# EAGLE design TinyRulerPE (EAGLE 9.6.2)
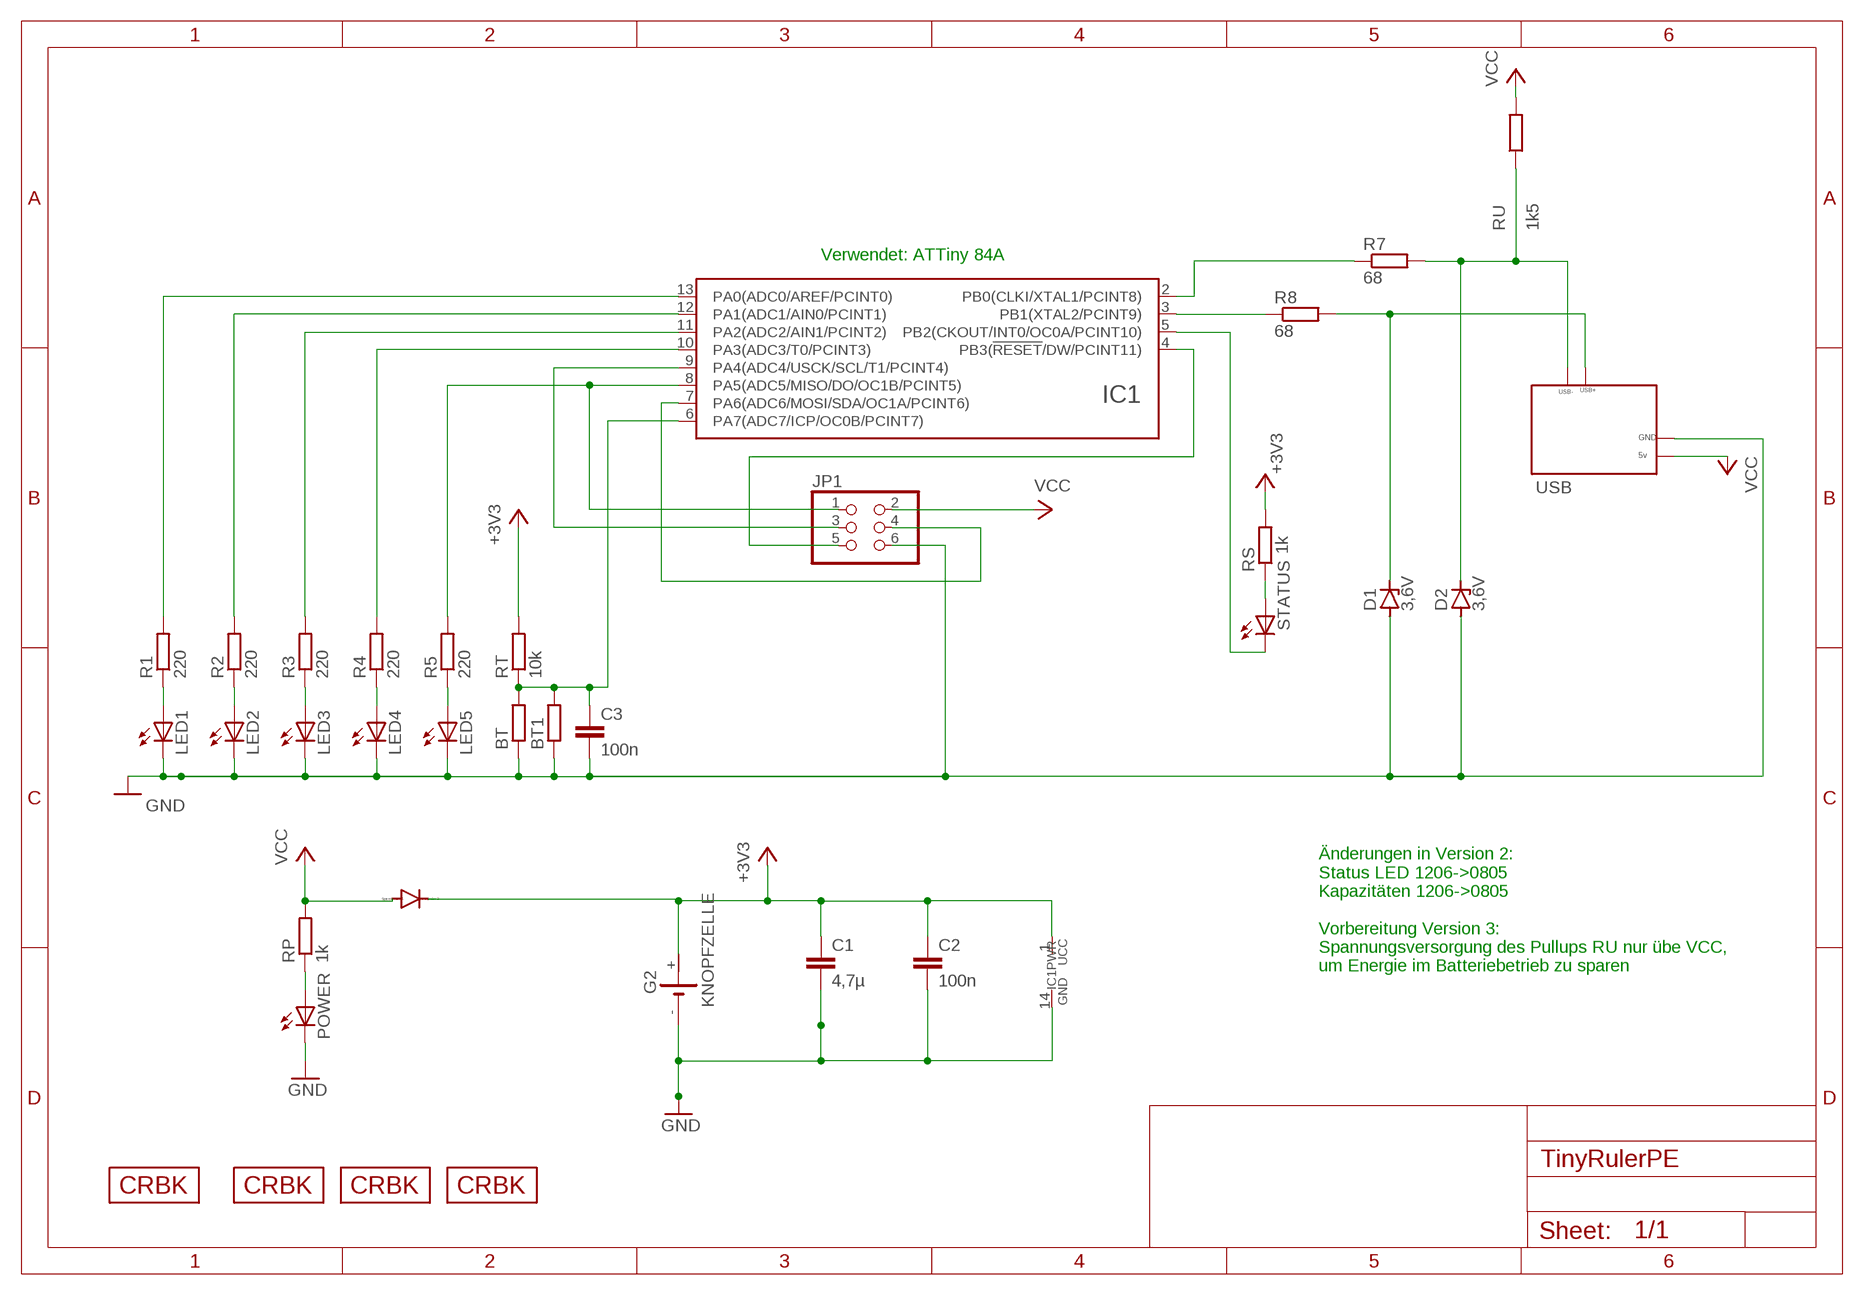
[diagram p0: schematic, sheet 1]

## Parts
BT  R-EU_0411/15  [0411/15]
BT1  R-EU_0309/10  [0309/10]
C1  4,7µ  C-EUC0805  [C0805]
C2  100n  C-EUC0805  [C0805]
C3  100n  C-EUC0805  [C0805]
D1  3,6V  ZENER-DIODESOT23  [SOT23]
D2  3,6V  ZENER-DIODESOT23  [SOT23]
D4  DIODE-SOD323-W  [SOD323-W]
G2  KNOPFZELLE  [KZH20]
IC1  ATTINY24/44/84-SSU  [SOIC14]
JP1  PINHD-2X3  [2X03]
L1  CRBKLOGO-2020TN_TEXT  [CRBK-LOGO-2020-XS-TN-TEXT]
L2  CRBKLOGO-2020TN_S_BILD  [CRBK-LOGO-2020-S-TN-BILD]
L3  CRBKLOGO-2020TN_S_BILD  [CRBK-LOGO-2020-S-TN-BILD]
L4  CRBKLOGO-2020TN_TEXT  [CRBK-LOGO-2020-XS-TN-TEXT]
LED1  LEDCHIPLED_1206  [CHIPLED_1206]
LED2  LEDCHIPLED_1206  [CHIPLED_1206]
LED3  LEDCHIPLED_1206  [CHIPLED_1206]
LED4  LEDCHIPLED_1206  [CHIPLED_1206]
LED5  LEDCHIPLED_1206  [CHIPLED_1206]
POWER  LEDCHIPLED_0805  [CHIPLED_0805]
R1  220  R-EU_R0805  [R0805]
R2  220  R-EU_R0805  [R0805]
R3  220  R-EU_R0805  [R0805]
R4  220  R-EU_R0805  [R0805]
R5  220  R-EU_R0805  [R0805]
R7  68  R-EU_R0805  [R0805]
R8  68  R-EU_R0805  [R0805]
RP  1k  R-EU_R0805  [R0805]
RS  1k  R-EU_R0805  [R0805]
RT  10k  R-EU_R0805  [R0805]
RU  1k5  R-EU_R0805  [R0805]
STATUS  LEDCHIPLED_0805  [CHIPLED_0805]
USB  USBCONNECTOR  [USBCONNECTOR]

## Nets
+3V3: C1.1 C2.1 D4.C G2.+ IC1.1(UCC) RS.2 RT.2
GND: BT1.1 BT.1 C1.2 C2.2 C3.2 D1.1(A) D2.1(A) G2.- IC1.14(GND) JP1.6 LED1.C LED2.C LED3.C LED4.C LED5.C POWER.C USB.GND
N$1: LED2.A R2.1
N$2: LED1.A R1.1
N$3: LED3.A R3.1
N$4: LED4.A R4.1
N$5: LED5.A R5.1
N$6: IC1.9(PA4(ADC4/USCK/SCL/T1/PCINT4)) JP1.3
N$7: IC1.8(PA5(ADC5/MISO/DO/OC1B/PCINT5)) JP1.1 R5.2
N$8: IC1.13(PA0(ADC0/AREF/PCINT0)) R1.2
N$9: IC1.4(PB3(!RESET!/DW/PCINT11)) JP1.5
N$10: BT1.2 BT.2 C3.1 IC1.6(PA7(ADC7/ICP/OC0B/PCINT7)) RT.1
N$11: IC1.12(PA1(ADC1/AIN0/PCINT1)) R2.2
N$12: D1.3(C) R8.2 USB.USB+
N$13: D2.3(C) R7.2 RU.1 USB.USB-
N$14: IC1.11(PA2(ADC2/AIN1/PCINT2)) R3.2
N$15: POWER.A RP.1
N$16: IC1.5(PB2(CKOUT/INT0/OC0A/PCINT10)) STATUS.C
N$17: IC1.7(PA6(ADC6/MOSI/SDA/OC1A/PCINT6)) JP1.4
N$18: RS.1 STATUS.A
N$19: IC1.10(PA3(ADC3/T0/PCINT3)) R4.2
N$20: IC1.2(PB0(CLKI/XTAL1/PCINT8)) R7.1
N$21: IC1.3(PB1(XTAL2/PCINT9)) R8.1
VCC: D4.A JP1.2 RP.2 RU.2 USB.+5V(5V)

## Notes on the sheet
- Verwendet: ATTiny 84A
- Änderungen in Version 2:
  Status LED 1206->0805
  Kapazitäten 1206->0805
  
  Vorbereitung Version 3:
  Spannungsversorgung des Pullups RU nur übe VCC,
  um Energie im Batteriebetrieb zu sparen

## Library data of the parts
BT BT1 R1-R5 R7 R8 RP RS RT RU = rcl:R-EU_: RESISTOR, European symbol; SPICEPREFIX: R
C1-C3 = rcl:C-EU: CAPACITOR, European symbol; SPICEPREFIX: C
D1 D2 = diode:ZENER-DIODE: Z-Diode
D4 = diode:DIODE-: DIODE
G2 = CRBK:KNOPFZELLE: LI BATTERY
IC1 = atmel_tiny24-44-84tiny48-88mega48-88-168-328:ATTINY24/44/84
JP1 = pinhead:PINHD-2X3: PIN HEADER
L1-L4 = CRBK:CRBKLOGO-2020
LED1-LED5 POWER STATUS = 1a BK_Hennef 10_18:LED: LED OSRAM: - CHIPLED LG R971, LG N971, LY N971, LG Q971, LY Q971, LO R971, LY R971 LH N974, LH R974 LS Q976, LO Q976, LY Q976 LO Q996 - Hyper CHIPLED LW Q18S LB Q993, LB Q99A, LB R99A - SideLED LS A670, LO A670, LY A670, LG A670, LP A670 LB A673, LV A673, LT A673, LW A673 LH A674 LY A675 LS A676, LA A676, LO A676, LY A676, LW A676 LS A679, LY A679, LG A679 - Hyper Micro SIDELED® LS Y876, LA Y876, LO Y876, LY Y876 LT Y87S - SmartLED LW L88C, LW L88S LB L89C, LB L89S, LG L890 LS L89K, LO L89K, LY L89K LS L896, LA L896, LO L896, LY L896 - TOPLED LS T670, LO T670, LY T670, LG T670, LP T670 LSG T670, LSP T670, LSY T670, LOP T670, LYG T670 LG T671, LOG T671, LSG T671 LB T673, LV T673, LT T673, LW T673 LH T674 LS T676, LA T676, LO T676, LY T676, LB T676, LH T676, LSB T676, LW T676 LB T67C, LV T67C, LT T67C, LS T67K, LO T67K, LY T67K, LW E67C LS E67B, LA E67B, LO E67B, LY E67B, LB E67C, LV E67C, LT E67C LW T67C LS T679, LY T679, LG T679 LS T770, LO T770, LY T770, LG T770, LP T770 LB T773, LV T773, LT T773, LW T773 LH T774 LS E675, LA E675, LY E675, LS T675 LS T776, LA T776, LO T776, LY T776, LB T776 LHGB T686 LT T68C, LB T68C - Hyper Mini TOPLED® LB M676 - Mini TOPLED Santana® LG M470 LS M47K, LO M47K, LY M47K Source: http://www.osram.convergy.de LUXEON: - LUMILED® LXK2-PW12-R00, LXK2-PW12-S00, LXK2-PW14-U00, LXK2-PW14-V00 LXK2-PM12-R00, LXK2-PM12-S00, LXK2-PM14-U00 LXK2-PE12-Q00, LXK2-PE12-R00, LXK2-PE12-S00, LXK2-PE14-T00, LXK2-PE14-U00 LXK2-PB12-K00, LXK2-PB12-L00, LXK2-PB12-M00, LXK2-PB14-N00, LXK2-PB14-P00, LXK2-PB14-Q00 LXK2-PR12-L00, LXK2-PR12-M00, LXK2-PR14-Q00, LXK2-PR14-R00 LXK2-PD12-Q00, LXK2-PD12-R00, LXK2-PD12-S00 LXK2-PH12-R00, LXK2-PH12-S00 LXK2-PL12-P00, LXK2-PL12-Q00, LXK2-PL12-R00 Source: www.luxeon.com KINGBRIGHT: KA-3528ASYC Source: www.kingbright.com
USB = srg:USBCONNECTOR

## Board
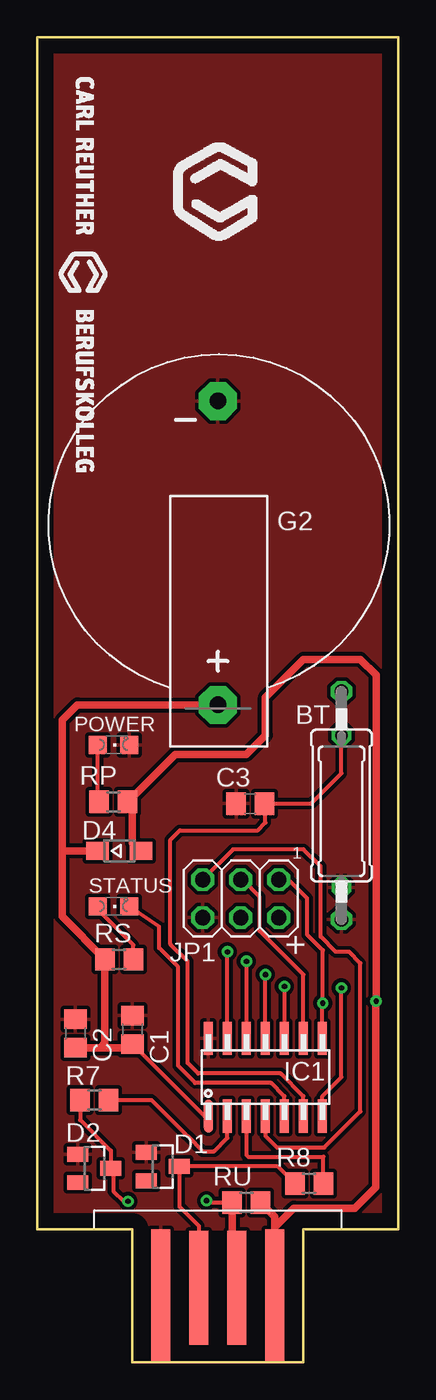
[diagram p1: board, top side]
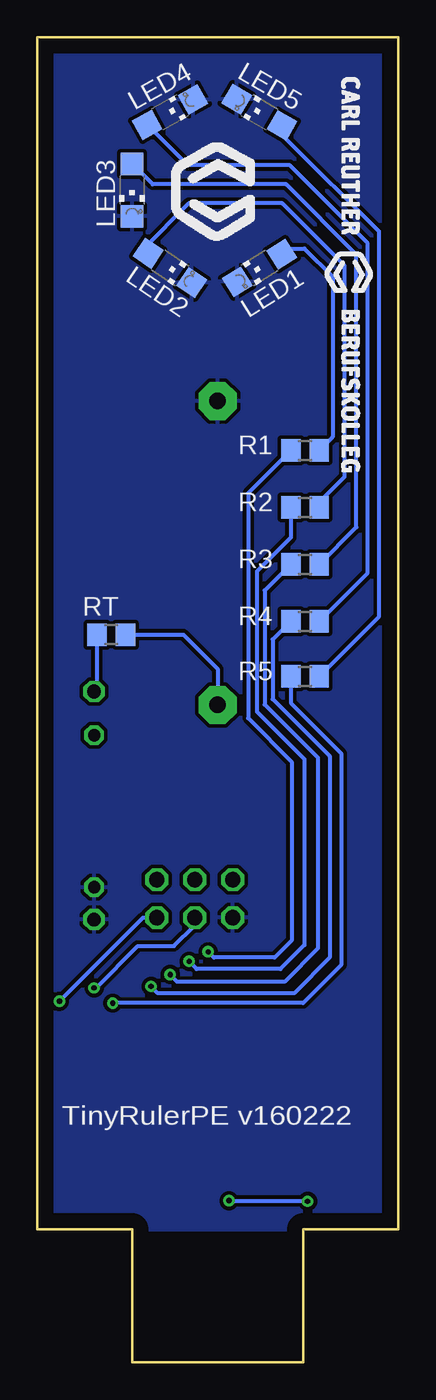
[diagram p2: board, bottom side, seen from below]

Size 24.11 x 88.57 mm. Coordinates in mm from the lower left corner, seen from the top.
Outline: 0,8.89 6.35,8.89 6.35,0 17.78,0 17.78,8.89 24.11,8.89 24.11,88.57 0,88.57 0,8.89
Copper layers (1*16): Top 0.035mm / dielectric 1.5mm / Bottom 0.035mm
Design rules "default": minimum track width 6mil, minimum drill 0.35mm, track to track 6mil, track to pad 6mil, pad to pad 6mil, via to via 6mil, smd to smd 6mil, copper to edge 40mil, drill to drill 6mil, minimum pad ring 10mil, minimum via ring 8mil, stop-mask expansion 4mil, vias tented up to drill 0mil, thermal gap 10mil

### Footprints (pad centres in the part's own frame; a part is rotated, then mirrored left to right if it is on the bottom)
0411/15 = drill 0.914 octagon: 1 -7.62,0; 2 7.62,0
0309/10 = drill 0.813 octagon: 1 -5.08,0; 2 5.08,0
C0805 = smd 1.3 x 1.5: 1 -0.95,0; 2 0.95,0
SOT23 = smd 1 x 1.4: 1 -0.95,-1.1; 2 0.95,-1.1; 3 0,1.1
SOD323-W = smd 1.5 x 1.2: A 1.45,0; C -1.45,0
KZH20 = drill 1.118 pad 2.54 octagon: + 0,12.065; - 0,-8.255
SOIC14 = smd 0.61 x 2.21: 1 -3.81,-2.603; 2 -2.54,-2.603; 3 -1.27,-2.603; 4 0,-2.603; 5 1.27,-2.603; 6 2.54,-2.603; 7 3.81,-2.603; 8 3.81,2.603; 9 2.54,2.603; 10 1.27,2.603; 11 0,2.603; 12 -1.27,2.603; 13 -2.54,2.603; 14 -3.81,2.603
2X03 = drill 1.016 octagon: 1 -2.54,-1.27; 2 -2.54,1.27; 3 0,-1.27; 4 0,1.27; 5 2.54,-1.27; 6 2.54,1.27
CHIPLED_1206 = smd 1.5 x 1.5: A 0,-1.75; C 0,1.75
CHIPLED_0805 = smd 1.2 x 1.2: A 0,-1.05; C 0,1.05
R0805 = smd 1.3 x 1.5: 1 -0.95,0; 2 0.95,0
USBCONNECTOR = smd 1.27 x 8.89: +5V 12.065,-4.445; GND 4.445,-4.445 | smd 1.27 x 7.62: USB+ 6.985,-3.937; USB- 9.525,-3.937

### Placement (x,y rotation side)
BT  20.32,37.21 90 top
BT1  20.32,36.83 90 top
C1  6.35,22.23 90 top
C2  2.54,21.97 90 top
C3  14.22,37.34 180 top
D1  8.38,13.08 270 top
D2  3.81,12.95 270 top
D4  5.46,34.16 0 top
G2  12.06,56.01 180 top
IC1  15.24,19.05 0 top
JP1  13.59,30.99 180 top
L1  5.08,86.36 270 bottom
L2  15.24,75.06 0 bottom
L3  9.02,75.06 0 top
L4  1.27,86.36 270 top
LED1  9.27,73.15 122 bottom
LED2  15.24,73.15 236 bottom
LED3  17.78,78.36 180 bottom
LED4  15.24,83.57 299 bottom
LED5  9.27,83.57 60 bottom
POWER  5.08,41.27 270 top
R1  6.22,60.96 180 bottom
R2  6.22,57.15 180 bottom
R3  6.22,53.34 180 bottom
R4  6.22,49.53 180 bottom
R5  6.22,45.85 180 bottom
R7  3.81,17.53 180 top
R8  18.16,11.94 180 top
RP  5.08,37.47 0 top
RS  5.46,26.92 180 top
RT  19.18,48.64 0 bottom
RU  13.97,10.67 0 top
STATUS  5.08,30.48 270 top
USB  3.81,8.89 0 top

### Tracks (layer width: path | path; a pad name or v marks a point on that pad's centre or on a via)
+3V3
  Top 0.254: IC1.1 11.18,16.45 C1.1 | 1.78,34.16 1.65,34.29
  Top 0.508: D4.C 1.78,34.16 | G2.+ 2.67,43.94 1.65,42.93 1.65,34.29 1.65,29.78 RS.2 4.51,21.34 4.19,21.02 C2.1 6.1,21.02 C1.1
  Bottom 0.254: RT.2 14.35,48.64 12.06,46.36 G2.+
GND
  pour Bottom (isolate 0.254): 0,88.9 24.13,88.9 24.13,8.89 0,8.89
  pour Top (isolate 0.254): 0,8.89 24.13,8.89 24.13,88.9 0,88.9
N$1
  Bottom 0.254: R2.1 5.27,57.51 3.58,59.2 3.58,73.31 7.75,77.47 13.99,77.47 17.01,74.45 LED2.A
N$2
  Bottom 0.254: R1.1 4.38,61.85 4.38,72.58 6.26,74.46 7.41,74.46 LED1.A
N$3
  Bottom 0.254: R3.1 2.79,55.82 2.79,74.04 7.49,78.74 16.41,78.74 LED3.A
N$4
  Bottom 0.254: R4.1 2.03,52.77 2.03,74.8 7.24,80.01 14.06,80.01 LED4.A
N$5
  Bottom 0.254: R5.1 1.27,49.85 1.27,75.56 7.5,81.8 7.5,82.44 LED5.A
N$6
  Top 0.254: IC1.9 17.78,25.91 14.86,28.83 14.86,31.12 13.72,32.26 JP1.3
N$7  (via drill 0.35)
  Top 0.254: IC1.8 19.05,23.98 v19.07,24 19.07,27.54 18.03,28.57 18.03,30.99 16.76,32.26 JP1.1
  Bottom 0.254: R5.2 7.17,44.07 3.81,40.71 3.81,26.54 6.35,24 v19.07,24
N$8  (via drill 0.35)
  Top 0.254: IC1.13 v12.7,27.43
  Bottom 0.254: R1.2 10.03,58.1 10.03,43.05 7.11,40.13 7.11,28.19 8.26,27.05 12.32,27.05 v12.7,27.43
N$9
  Top 0.254: IC1.4 15.24,15.11 16,14.35 19.18,14.35 21.59,16.76 21.59,26.67 20.83,27.43 19.94,27.43 18.92,28.45 18.92,33.15 17.78,34.29 13.08,34.29 JP1.5
N$10
  Top 0.152: BT1.2 BT.2
  Top 0.254: IC1.6 17.78,17.78 16.26,19.3 10.73,19.3 10.03,20.01 10.03,26.8 8.89,27.94 8.89,34.92 9.53,35.56 14.73,35.56 15.24,36.07 15.24,37.34 | C3.1 15.24,37.34 | 15.24,37.34 18.29,37.34 20.32,39.37 BT.2
  Bottom 0.254: RT.1 20.13,45.02 BT.2
N$11  (via drill 0.35)
  Top 0.254: v13.97,26.8 IC1.12
  Bottom 0.254: R2.2 7.17,55.13 9.45,52.86 9.45,43.48 6.27,40.31 6.27,27.89 7.87,26.29 13.46,26.29 v13.97,26.8
N$12
  Top 0.254: R8.2 16.07,13.08 D1.3 9.48,10.41 10.79,9.1 USB.USB+
N$13  (via drill 0.35)
  Top 0.254: R7.2 2.86,16.19 4.91,14.14 D2.3 5.08,12.78 5.08,11.43 5.76,10.75 v6.05,10.75 | v11.3,10.79 11.43,10.67 RU.1
  Top 0.508: RU.1 13.02,5.27 USB.USB-
  Bottom 0.254: v11.3,10.79 6.1,10.79 v6.05,10.75
N$14  (via drill 0.35)
  Top 0.254: IC1.11 v15.24,25.91
  Bottom 0.254: R3.2 8.91,51.6 8.91,43.97 5.36,40.41 5.36,27.66 7.6,25.43 14.76,25.43 v15.24,25.91
N$15
  Top 0.254: RP.1 4.03,37.56 POWER.A
N$16
  Top 0.254: IC1.5 16.51,17.78 15.62,18.67 10.54,18.67 9.4,19.81 9.4,26.42 8.13,27.69 8.13,29.11 STATUS.C
N$17  (via drill 0.35)
  Top 0.254: IC1.7 19.05,17.78 20.32,19.05 v20.32,25.02
  Bottom 0.254: v20.32,25.02 20.19,25.02 17.4,27.81 14.99,27.81 13.59,29.21 JP1.4
N$18
  Top 0.254: RS.1 6.41,27.88 4.03,30.26 STATUS.A
N$19  (via drill 0.35)
  Top 0.254: v16.51,25.12 IC1.10
  Bottom 0.254: R4.2 8.38,48.32 8.38,44.32 4.57,40.51 4.57,27.05 6.96,24.66 16.05,24.66 v16.51,25.12
N$20
  Top 0.254: IC1.2 12.7,14.99 11.81,14.1 11.05,14.1 10.03,15.11 9.91,15.24 7.62,17.53 R7.1
N$21
  Top 0.254: R8.1 19.11,13.74 14.07,13.74 13.97,13.84 IC1.3
VCC  (via drill 0.35)
  Top 0.254: RP.2 6.35,37.47
  Top 0.508: D4.A 6.35,34.72 6.35,37.47 | RP.2 9.21,40.64 13.97,40.64 15.24,41.91 15.24,44.45 17.78,46.99 21.59,46.99 22.64,45.94 v22.64,24.13 22.61,24.1 22.61,11.68 21.21,10.29 17.14,10.29 15.88,9.02 USB.+5V 15.88,9.71 RU.2
  Bottom 0.254: v22.64,24.13 17.05,29.72 JP1.2

### Text on the board
tNames: 1 | +
bNames: TinyRulerPE v160222